# EAGLE design Vcc+GndConnected (EAGLE 9.1.0)
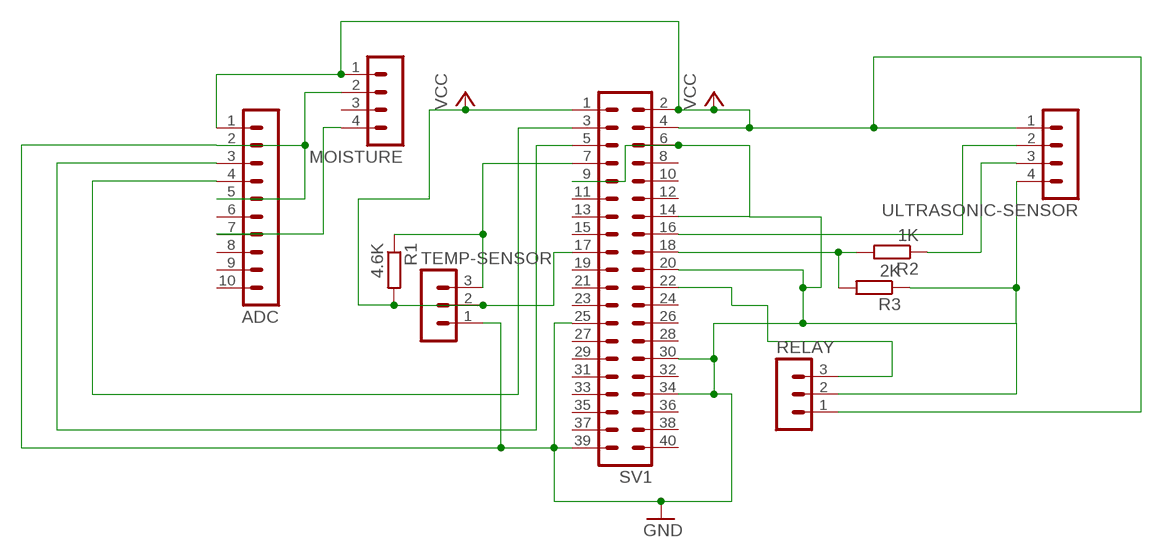
[diagram p0: schematic, sheet 1]

## Parts
ADC  MA10-1  [MA10-1]
MOISTURE  MA04-1  [MA04-1]
R1  4.6K  R-EU_0207/10  [0207/10]
R2  1K  R-EU_0207/10  [0207/10]
R3  2K  R-EU_0207/10  [0207/10]
RELAY  MA03-1  [MA03-1]
SV1  MA20-2  [MA20-2]
TEMP-SENSOR  MA03-1  [MA03-1]
ULTRASONIC-SENSOR  MA04-1  [MA04-1]

## Nets
GND: ADC.2 ADC.5 MOISTURE.2 R3.1 RELAY.2 SV1.6 SV1.9 SV1.14 SV1.20 SV1.25 SV1.30 SV1.34 SV1.39 TEMP-SENSOR.1 ULTRASONIC-SENSOR.4
N$4: R2.1 ULTRASONIC-SENSOR.3
N$5: SV1.16 ULTRASONIC-SENSOR.2
N$7: R2.2 R3.2 SV1.18
N$10: ADC.3 SV1.5
N$11: ADC.4 SV1.3
N$12: ADC.7 MOISTURE.4
N$13: RELAY.3 SV1.22
N$14: R1.1 SV1.7 TEMP-SENSOR.3
VCC: ADC.1 MOISTURE.1 R1.2 RELAY.1 SV1.1 SV1.2 SV1.4 SV1.17 TEMP-SENSOR.2 ULTRASONIC-SENSOR.1
Unconnected: ADC.6 ADC.8 ADC.9 ADC.10 MOISTURE.3 SV1.8 SV1.10 SV1.11 SV1.12 SV1.13 SV1.15 SV1.19 SV1.21 SV1.23 SV1.24 SV1.26 SV1.27 SV1.28 SV1.29 SV1.31 SV1.32 SV1.33 SV1.35 SV1.36 SV1.37 SV1.38 SV1.40

## Library data of the parts
ADC = con-lstb:MA10-1: PIN HEADER; OC_FARNELL: unknown; OC_NEWARK: unknown
MOISTURE ULTRASONIC-SENSOR = con-lstb:MA04-1: PIN HEADER; OC_FARNELL: unknown; OC_NEWARK: unknown
R1-R3 = resistor:R-EU_: RESISTOR, European symbol
RELAY TEMP-SENSOR = con-lstb:MA03-1: PIN HEADER; OC_FARNELL: unknown; OC_NEWARK: unknown
SV1 = con-lstb:MA20-2: PIN HEADER; OC_FARNELL: unknown; OC_NEWARK: unknown

## Board
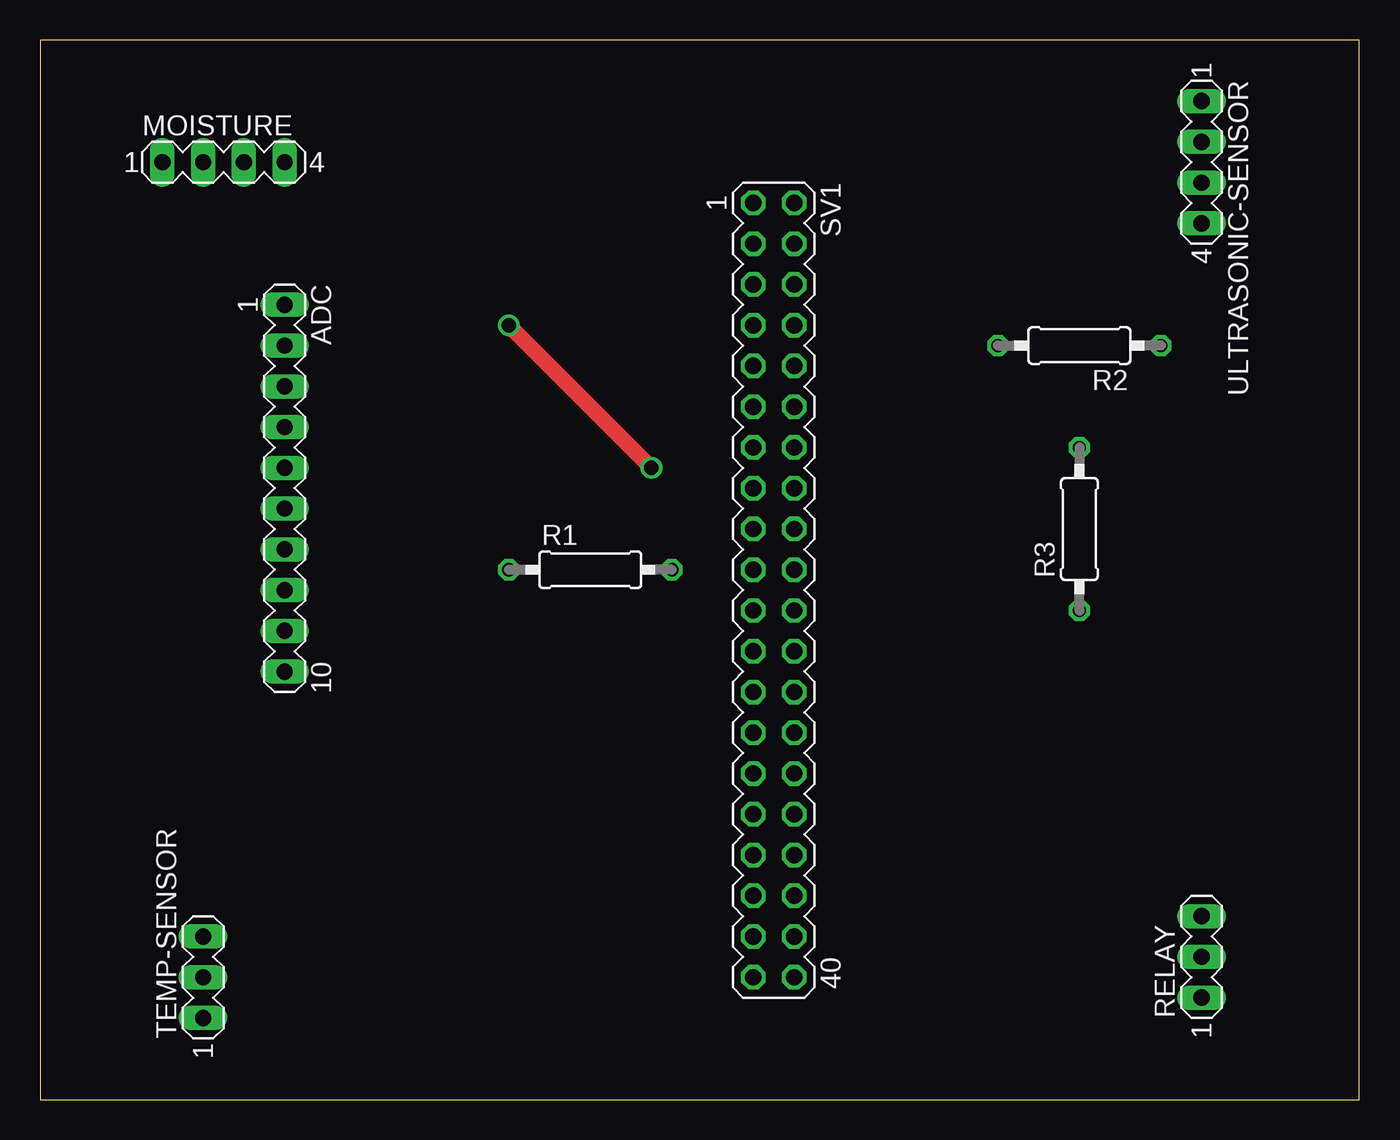
[diagram p1: board, top side]
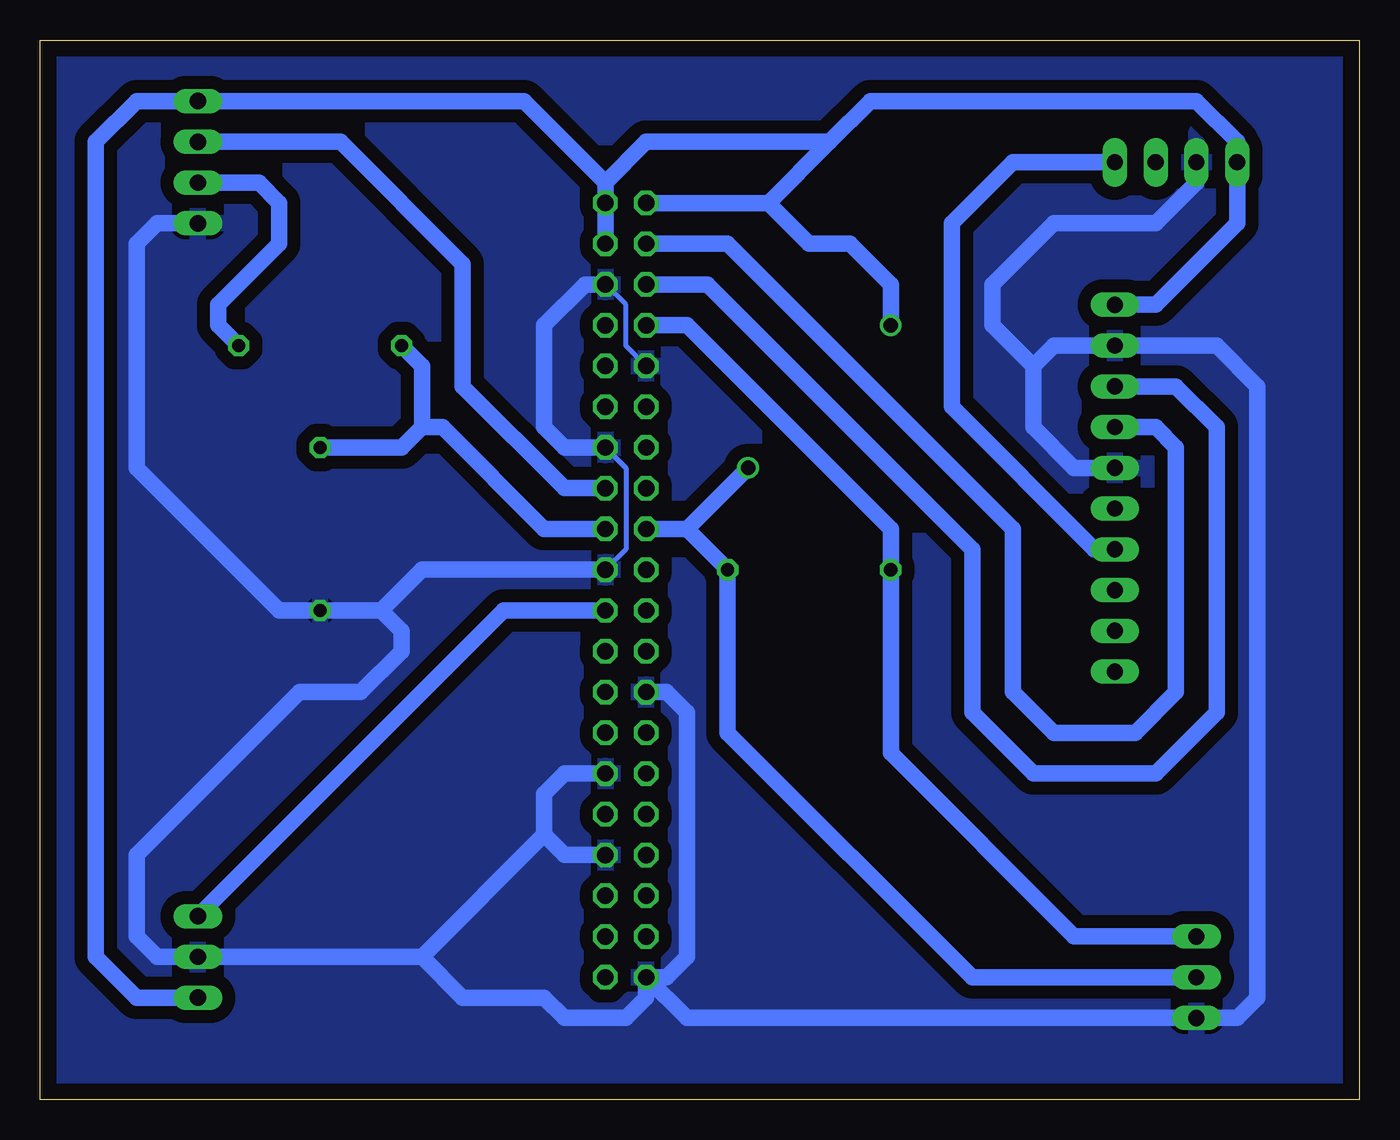
[diagram p2: board, bottom side, seen from below]

Size 82.22 x 66.03 mm. Coordinates in mm from the lower left corner, seen from the top.
Outline: 0,0 82.22,0 82.22,66.03 0,66.03 0,0
Copper layers (1*16): Top 0.035mm / dielectric 1.5mm / Bottom 0.035mm
Design rules "default": minimum track width 6mil, minimum drill 0.35mm, track to track 6mil, track to pad 6mil, pad to pad 6mil, via to via 6mil, smd to smd 6mil, copper to edge 40mil, drill to drill 6mil, minimum pad ring 10mil, minimum via ring 8mil, stop-mask expansion 4mil, vias tented up to drill 0mil, thermal gap 10mil

### Footprints (pad centres in the part's own frame; a part is rotated, then mirrored left to right if it is on the bottom)
MA10-1 = drill 1.016 long: 1 -11.43,0; 2 -8.89,0; 3 -6.35,0; 4 -3.81,0; 5 -1.27,0; 6 1.27,0; 7 3.81,0; 8 6.35,0; 9 8.89,0; 10 11.43,0
MA04-1 = drill 1.016 long: 1 -3.81,0; 2 -1.27,0; 3 1.27,0; 4 3.81,0
0207/10 = drill 0.813 octagon: 1 -5.08,0; 2 5.08,0
MA03-1 = drill 1.016 long: 1 -2.54,0; 2 0,0; 3 2.54,0
MA20-2 = drill 1.016 octagon: 1 -24.13,-1.27; 2 -24.13,1.27; 3 -21.59,-1.27; 4 -21.59,1.27; 5 -19.05,-1.27; 6 -19.05,1.27; 7 -16.51,-1.27; 8 -16.51,1.27; 9 -13.97,-1.27; 10 -13.97,1.27; 11 -11.43,-1.27; 12 -11.43,1.27; 13 -8.89,-1.27; 14 -8.89,1.27; 15 -6.35,-1.27; 16 -6.35,1.27; 17 -3.81,-1.27; 18 -3.81,1.27; 19 -1.27,-1.27; 20 -1.27,1.27; 21 1.27,-1.27; 22 1.27,1.27; 23 3.81,-1.27; 24 3.81,1.27; 25 6.35,-1.27; 26 6.35,1.27; 27 8.89,-1.27; 28 8.89,1.27; 29 11.43,-1.27; 30 11.43,1.27; 31 13.97,-1.27; 32 13.97,1.27; 33 16.51,-1.27; 34 16.51,1.27; 35 19.05,-1.27; 36 19.05,1.27; 37 21.59,-1.27; 38 21.59,1.27; 39 24.13,-1.27; 40 24.13,1.27

### Placement (x,y rotation side)
ADC  15.24,38.1 270 top
MOISTURE  11.43,58.42 0 top
R1  34.29,33.02 0 top
R2  64.77,46.99 180 top
R3  64.77,35.56 90 top
RELAY  72.39,8.89 90 top
SV1  45.72,31.75 270 top
TEMP-SENSOR  10.16,7.62 90 top
ULTRASONIC-SENSOR  72.39,58.42 270 top

### Tracks (layer width: path | path; a pad name or v marks a point on that pad's centre or on a via)
GND
  Bottom 0.305: SV1.9 45.72,46.99 45.72,49.53 SV1.6 | SV1.14 45.72,39.37 45.72,34.29 SV1.20
  Bottom 1.016: ADC.2 16.51,46.99 | SV1.20 58.42,33.02 60.96,30.48 | 60.96,30.48 R3.1 67.31,30.48 76.2,39.37 76.2,53.34 74.93,54.61 ULTRASONIC-SENSOR.4 | 60.96,30.48 59.69,29.21 59.69,27.94 62.23,25.4 66.04,25.4 76.2,15.24 76.2,10.16 74.93,8.89 RELAY.2 58.42,8.89 | SV1.25 43.18,25.4 41.91,24.13 41.91,8.89 43.18,7.62 SV1.39 | SV1.39 44.45,6.35 45.72,5.08 49.53,5.08 50.8,6.35 55.88,6.35 58.42,8.89 | MOISTURE.2 10.16,57.15 12.7,54.61 19.05,54.61 22.86,50.8 22.86,48.26 20.32,45.72 | SV1.39 41.91,5.08 TEMP-SENSOR.1 7.62,5.08 6.35,6.35 6.35,44.45 8.89,46.99 ADC.2 | ADC.5 17.78,39.37 20.32,41.91 20.32,45.72 | 20.32,45.72 19.05,46.99 ADC.2 | SV1.6 48.26,50.8 50.8,48.26 50.8,41.91 49.53,40.64 SV1.14 | SV1.30 49.53,20.32 50.8,19.05 50.8,16.51 | 50.8,16.51 49.53,15.24 SV1.34 | 50.8,16.51 58.42,8.89
  pour Bottom (isolate 0.813): 0,66.04 82.55,66.04 82.55,0 0,0
N$4
  Bottom 1.016: ULTRASONIC-SENSOR.3 68.58,57.15 67.31,55.88 67.31,53.34 71.12,49.53 71.12,48.26 R2.1
N$5
  Bottom 1.016: SV1.16 49.53,38.1 55.88,44.45 55.88,52.07 63.5,59.69 67.31,59.69 68.58,59.69 ULTRASONIC-SENSOR.2
N$7
  Bottom 1.016: SV1.18 50.8,35.56 57.15,41.91 58.42,41.91 | R2.2 58.42,45.72 58.42,41.91 | 58.42,41.91 59.69,40.64 R3.2
N$10
  Bottom 1.016: SV1.5 40.64,50.8 24.13,34.29 24.13,24.13 20.32,20.32 12.7,20.32 8.89,24.13 8.89,41.91 11.43,44.45 ADC.3
N$11
  Bottom 1.016: SV1.3 39.37,53.34 21.59,35.56 21.59,25.4 19.05,22.86 13.97,22.86 11.43,25.4 11.43,40.64 12.7,41.91 ADC.4
N$12
  Bottom 1.016: MOISTURE.4 21.59,58.42 25.4,54.61 25.4,43.18 16.51,34.29 ADC.7
N$13
  Bottom 1.016: SV1.22 53.34,30.48 RELAY.3
N$14
  Bottom 1.016: SV1.7 41.91,48.26 29.21,35.56 R1.1 29.21,21.59 17.78,10.16 TEMP-SENSOR.3
VCC  (via drill 0.9 pad 1.3)
  Top 1.016: v38.1,39.37 v29.21,48.26
  Bottom 1.016: 33.02,59.69 44.45,59.69 46.99,57.15 | 46.99,57.15 SV1.2 SV1.4 | ADC.1 12.7,49.53 7.62,54.61 MOISTURE.1 7.62,59.69 10.16,62.23 30.48,62.23 33.02,59.69 | RELAY.1 76.2,6.35 78.74,8.89 78.74,59.69 76.2,62.23 ULTRASONIC-SENSOR.1 52.07,62.23 46.99,57.15 | 41.91,35.56 R1.2 39.37,22.86 24.13,7.62 TEMP-SENSOR.2 | 41.91,35.56 SV1.17 | SV1.1 36.83,55.88 | 33.02,59.69 36.83,55.88 | 41.91,35.56 v38.1,39.37 | v29.21,48.26 29.21,50.8 31.75,53.34 34.29,53.34 36.83,55.88